# EasyEDA Pro project THMI_2024-07-26.epro

# Schematic Schematic1
Create Date: 2024-07-16; Page Name: P1; Project Name: #第九届立创电赛#温湿度检测仪; Schematic Name: Schematic1; Update Date: 2024-07-17
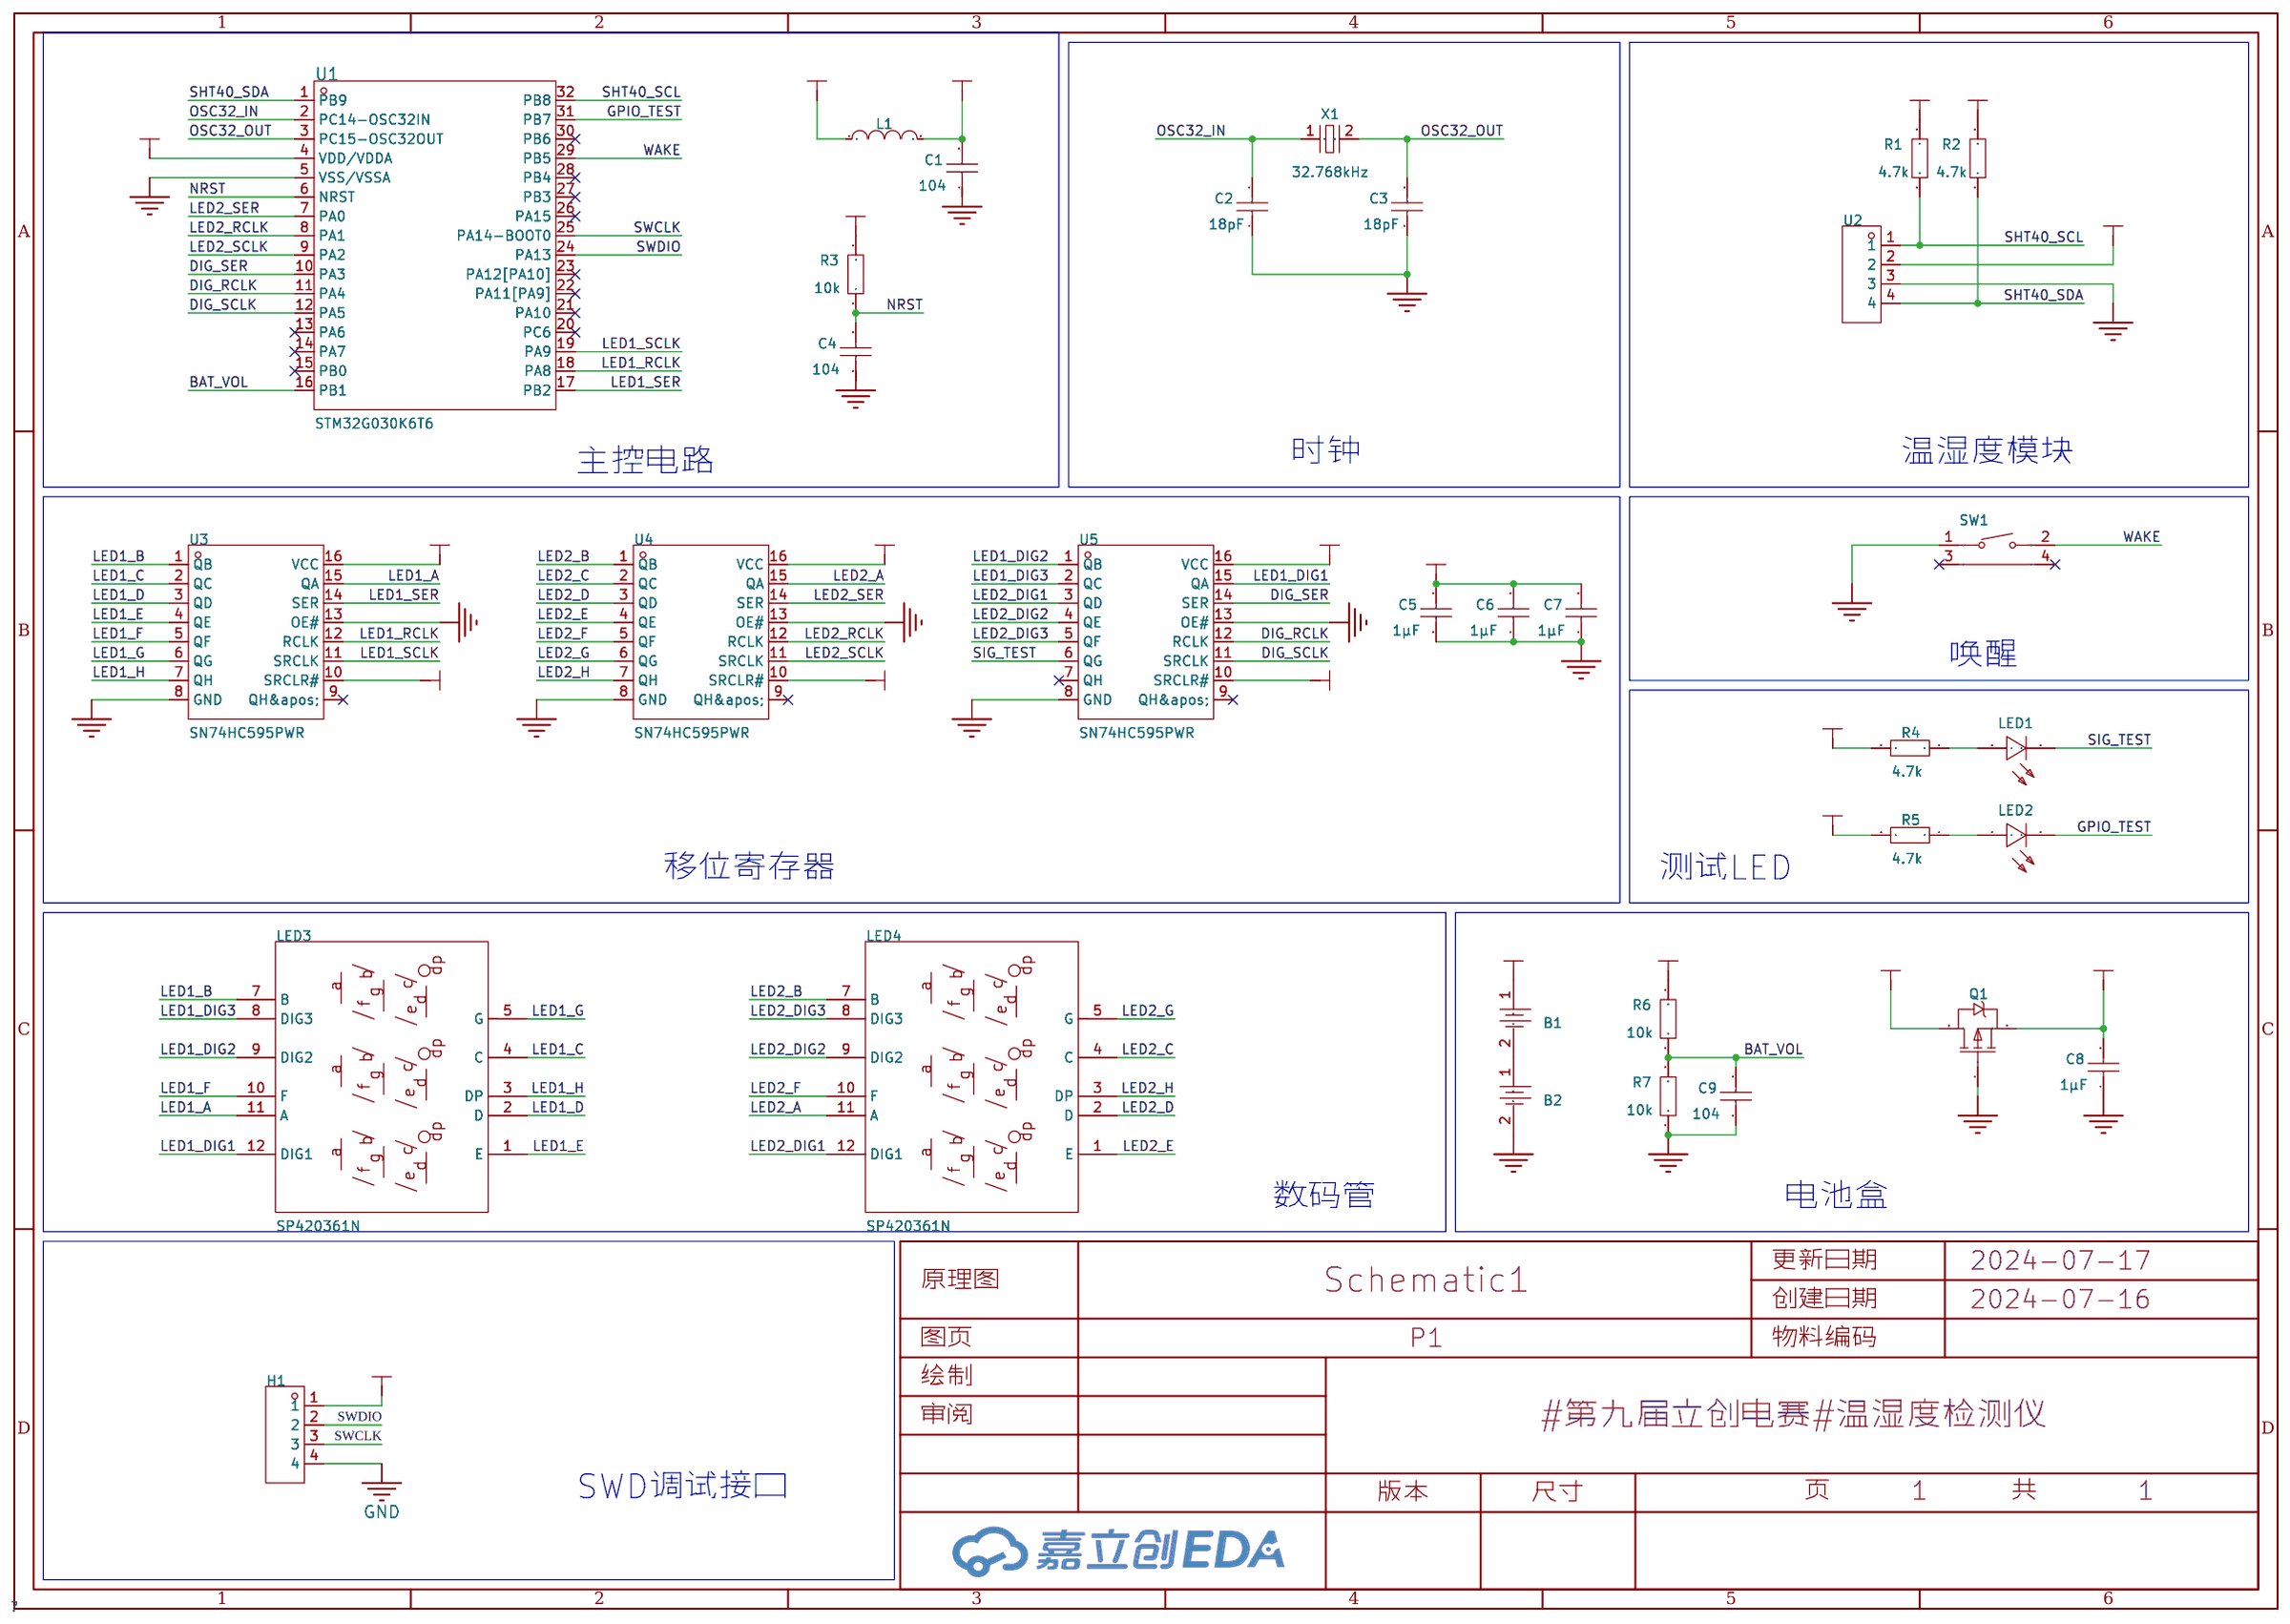
[diagram p0: schematic sheet]

## Parts
B1  BH-AA-A5BJ012  [BAT-TH_BH-AA-A5BJ012]
B2  BH-AA-A5BJ012  [BAT-TH_BH-AA-A5BJ012]
C1  104  [C0603]
C2  18pF  [C0603]
C3  18pF  [C0603]
C4  104  [C0603]
C5  1μF  [C0603]
C6  1μF  [C0603]
C7  1μF  [C0603]
C8  1μF  [C0603]
C9  104  [C0603]
H1  -  [HDR-TH_4P-P2.54-V-F]
L1  BLM21PG221SN1D  [L0805]
LED1  NCD0603G1  [LED0603-RD]
LED2  NCD0603G1  [LED0603-RD]
LED3  SP420361N  [LED-SEG-TH_SP420361N]
LED4  SP420361N  [LED-SEG-TH_SP420361N]
Q1  WST3401  [SOT-23-3_L2.9-W1.6-P1.90-LS2.8-BR]
R1  4.7k  [R0603]
R2  4.7k  [R0603]
R3  10k  [R0603]
R4  4.7k  [R0603]
R5  4.7k  [R0603]
R6  10k  [R0603]
R7  10k  [R0603]
SW1  TS-1010-C-A  [KEY-SMD_TX-1010-X-X]
U1  STM32G030K6T6  [LQFP-32_L7.0-W7.0-P0.80-LS9.0-BL]
U2  X1311FR-04-C43D24  [HDR-TH_4P-P1.27-H-F-W4.5-N]
U3  SN74HC595PWR  [TSSOP-16_L5.0-W4.4-P0.65-LS6.4-BL]
U4  SN74HC595PWR  [TSSOP-16_L5.0-W4.4-P0.65-LS6.4-BL]
U5  SN74HC595PWR  [TSSOP-16_L5.0-W4.4-P0.65-LS6.4-BL]
X1  32.768kHz  [CRYSTAL-SMD_L3.2-W1.5-1]

## Library data of the parts
B1 B2 = BH-AA-A5BJ012: 连接器类型:电池盒;适用电池规格:5号;; LCSC Part Name: 电池盒 适用电池:5号; Supplier Part: C5290180; Manufacturer: MYOUNG(美阳); JLCPCB Part Class: 扩展库; Datasheet: https://atta.szlcsc.com/upload/public/pdf/source/20221129/39BBE9EF152B2F12CD5AEA2F9E97207C.pdf; Supplier: LCSC; Connector Type: 电池盒; Battery Type: 5号
C1-C9 = CL10B332KB8NNNC: 容值:3.3nF;精度:±10%;额定电压:50V;材质(温度系数):X7R;; LCSC Part Name: 3.3nF ±10% 50V; Supplier Part: C1613; Manufacturer: SAMSUNG(三星); Supplier Footprint: 0603; JLCPCB Part Class: 基础库; Datasheet: https://atta.szlcsc.com/upload/public/pdf/source/20160218/1457707763339.pdf; Supplier: LCSC; Tolerance: ±10%; Voltage Rated: 50V; Temperature Coefficient: X7R
H1 = HDR-F_2.54_1x4P: Supplier Part: C2718488; Supplier Footprint: 插件
L1 = BLM21PG221SN1D: 标称阻抗@测试频率:220Ω@100MHz;误差:±25%;直流电阻(RDC):45mΩ;; LCSC Part Name: 单路 0805磁珠 阻抗220Ω@100MHz; Supplier Part: C85840; Manufacturer: muRata(村田); Supplier Footprint: 0805; JLCPCB Part Class: 扩展库; Datasheet: https://atta.szlcsc.com/upload/public/pdf/source/20180326/C118443_3FAC30E9A4F0E6B81275543C61E0685E.pdf; Supplier: LCSC; Impedance @ Frequency: 220Ω@100MHz; Tolerance: ±25%; DC Resistance: 45mΩ; Current Rating: 2A; Circuits: 1
LED1 LED2 = NCD0603G1: 发光颜色:翠绿色;正向电压(VF):2.6V~3.6V;功率:72mW;正向电流:10mA;主波长:515nm~530nm;透镜颜色:无色透明透镜;发光强度:330mcd~900mcd;发光角度:130°;工作温度:-30℃~+85℃;; Supplier Part: C84267; Manufacturer: 国星光电; Supplier Footprint: 0603; Datasheet: https://atta.szlcsc.com/upload/public/pdf/source/20200820/C84267_04BA7703640BAC111D09F5EFB971FBF3.pdf; Supplier: LCSC; Emitted Color: 翠绿色; Forward Voltage (VF): 2.6V~3.6V; Power Dissipation: 72mW; Forward Current: 10mA; Dominant Wavelength: 515nm~530nm; Lens Color: 无色透明透镜; Luminous Intensity: 330mcd~900mcd; Viewing Angle: 130°; Operating Temperature: -30℃~+85℃
LED3 LED4 = SP420361N: 数码管位数:3位;发光颜色:红色;LED极性:共阴极;数字/字母大小(英寸):0.36;; LCSC Part Name: 3位0.36英寸红色数码管 共阴极; Supplier Part: C98927; Manufacturer: ARKLED(方舟); Supplier Footprint: 插件; JLCPCB Part Class: 扩展库; Datasheet: https://atta.szlcsc.com/upload/public/pdf/source/20170713/C98927_1499918920582816853.pdf; Supplier: LCSC; Number of Characters: 3位; Luminous Color: 红色; LED Polarity: 共阴极; Digit/Alpha Size(inch): 0.36
Q1 = WST3401: 类型:1个P沟道;漏源电压(Vdss):30V;连续漏极电流(Id):5.5A;功率(Pd):1W;导通电阻(RDS(on)@Vgs,Id):52mΩ@10V,3A;阈值电压(Vgs(th)@Id):1.2V@250uA;; LCSC Part Name: 1个P沟道 耐压:30V 电流:5.5A; Supplier Part: C105162; Manufacturer: WINSOK(微硕); Supplier Footprint: SOT-23-3L; JLCPCB Part Class: 扩展库; Datasheet: https://atta.szlcsc.com/upload/public/pdf/source/20170518/1495085706351.pdf; Supplier: LCSC; Type: 1个P沟道; Drain Source Voltage (Vdss): 30V; Continuous Drain Current (Id): 5.5A; Power Dissipation (Pd): 1W; Drain Source On Resistance (RDS(on)@Vgs,Id): 52mΩ@10V,3A; Gate Threshold Voltage (Vgs(th)@Id): 1.2V@250uA
R1-R7 = 0603WAF4703T5E: 电阻类型:厚膜电阻;阻值:470kΩ;精度:±1%;功率:100mW;最大工作电压:75V;温度系数:±100ppm/℃;; LCSC Part Name: 470kΩ ±1% 100mW 厚膜电阻; Supplier Part: C23178; Manufacturer: UNI-ROYAL(厚声); Supplier Footprint: 0603; JLCPCB Part Class: 基础库; Datasheet: https://atta.szlcsc.com/upload/public/pdf/source/20200306/C422600_1E6D84923E4A46A82E41ADD87F860B5C.pdf; Supplier: LCSC; Type: 厚膜电阻; Tolerance: ±1%; Power(Watts): 100mW; Overload Voltage (Max): 75V; Temperature Coefficient: ±100ppm/℃; Operating Temperature Range: -55℃~+155℃
SW1 = TS-1010-C-A: 电路结构:单刀单掷;按钮形状:矩形按钮;作用力:260gf;安装方式:卧贴;开关长度:2.3mm;开关宽度:4.7mm;开关高度:3.5mm;带支架:不带;触点电流:50mA;额定电压(AC):-;额定电压(DC):12V;额定功率:-;绝缘电阻:-;带灯:无;机械寿命:10万次;; LCSC Part Name: 2.3*4.7*3.5mm 卧贴 轻触开关; Supplier Part: C692458; Manufacturer: XKB Connectivity(中国星坤); Supplier Footprint: SMD; Datasheet: https://atta.szlcsc.com/upload/public/pdf/source/20211011/09621D275CE0F472C941775DFBBCCC96.pdf; Supplier: LCSC; Circuit: 单刀单掷; Actuator Style: 矩形按钮; Operating Force: 260gf; Mounting Style: 卧贴; Switch Length: 2.3mm; Switch Width: 4.7mm; Switch Height: 3.5mm; Strike Gundam: 不带; Contact Current: 50mA; Voltage Rating (DC): 12V; Actuator/Cap Color: 黑色; With Lamp: 无; Mechanical Life: 10万次; Operating Temperature: -30℃~+85℃
U1 = STM32G030K6T6: CPU内核:CM0;程序存储容量:32KB;RAM总容量:8KB;GPIO端口数量:30;工作电压范围:2V~3.6V;CPU最大主频:64MHz;程序存储器类型:FLASH;; Supplier Part: C529331; Manufacturer: ST(意法半导体); Supplier Footprint: LQFP-32(7x7); JLCPCB Part Class: 扩展库; Datasheet: https://atta.szlcsc.com/upload/public/pdf/source/20200511/C529329_A1CB615556C746C4EA827FCAD1461480.pdf; Supplier: LCSC; CPU Core: CM0; Program Storage Size: 32KB; RAM Size: 8KB; GPIO Ports Number: 30; Operating Voltage Range: 2V~3.6V; CPU Maximum Speed: 64MHz; Program Memory Type: FLASH; Operating Temperature Range: -40℃~+85℃; ADC (Bit): 12bit; Peripheral/Function: DMA；PWM; Internal Oscillator: 有
U2 = X1311FR-04-C43D24: 插孔结构:1x4P;间距:1.27mm;行距:-;圆孔/方孔:方孔;安装类型:弯插;排数:单排;总孔位数:4P;额定电流:1A;额定电压:250V;插孔方向:侧面;塑高:4.3mm;触头材质:黄铜;触头镀层:金;工作温度范围:-40℃~+105℃;焊接温度(最大值):260℃;; LCSC Part Name: 间距:1.27mm 1x4P 弯插; Supplier Part: C2881475; Manufacturer: XKB Connectivity(中国星坤); Supplier Footprint: 弯插,P=1.27mm; JLCPCB Part Class: 扩展库; Datasheet: https://atta.szlcsc.com/upload/public/pdf/source/20211011/A24861EA633A2CD5B8EF341939930472.pdf; Supplier: LCSC; Holes Structure: 1x4P; Pitch: 1.27mm; Circular Hole / Square Hole: 方孔; Mounting Type: 弯插; Number of Rows: 单排; Number of Holes: 4P; Current Rating (Max): 1A; Voltage Rating (Max): 250V; Holes Direction: 侧面; Insulation Height: 4.3mm; Contact Material: 黄铜; Contact Plating: 金; Operating Temperature Range: -40℃~+105℃; Soldering Temperature(Max): 260℃
U3-U5 = SN74HC595PWR: 功能:串行至串行或并行;电源电压:2V~6V;元件数:1;每个元件位数:8;; LCSC Part Name: 三态输出 8位串行至串行或并行移位寄存器; Supplier Part: C273642; Manufacturer: TI(德州仪器); Supplier Footprint: TSSOP-16; JLCPCB Part Class: 扩展库; Datasheet: https://www.ti.com/cn/lit/gpn/sn74hc595; Supplier: LCSC; Function: 串行至串行或并行; Supply Voltage: 2V~6V; Number of Elements: 1; Number of Bits per Element: 8; Output Type: 三态; Series: 74HC; Operating Temperature: -40℃~+85℃
X1 = H31003271C2070CY: 晶振类型:贴片晶振;频率:32.768kHz;常温频差:±20ppm;外接负载电容:12.5pF;频率稳定度(全温):±30ppm;; LCSC Part Name: 32.768kHz ±20ppm 12.5pF; Supplier Part: C5361379; Manufacturer: JGHC(晶光华); Supplier Footprint: SMD3215-2P; JLCPCB Part Class: 扩展库; Datasheet: https://atta.szlcsc.com/upload/public/pdf/source/20240223/DA6BB0D04F2F206220D58296EAF6160A.pdf; Supplier: LCSC; Crystal Type: 贴片晶振; Normal temperature Frequency Tolerance: ±20ppm; External load capacitor: 12.5pF; Frequency Stability(Full temperature range): ±30ppm; Equivalent Series Resistance (ESR): 70kΩ; Operating Temperature: -40℃~+85℃

## Nets
3V: C5.2 C6.2 C7.2 C8.2 H1.1 L1.1 Q1.2(S) R1.2 R2.2 R3.2 R4.2 R5.2 R6.2 U2.2 U3.10(SRCLR#) U3.16(VCC) U4.10(SRCLR#) U4.16(VCC) U5.10(SRCLR#) U5.16(VCC)
GND: B2.2 C1.1 C2.1 C3.1 C4.1 C5.1 C6.1 C7.1 C8.1 C9.1 H1.4 Q1.1(G) R7.1 SW1.1 U1.5(VSS/VSSA) U2.3 U3.8(GND) U3.13(OE#) U4.8(GND) U4.13(OE#) U5.8(GND) U5.13(OE#)
VBAT: B1.1 Q1.3(D)
VDD: C1.2 L1.2 U1.4(VDD/VDDA)
BAT_VOL: C9.2 R6.1 R7.2 U1.16(PB1)
DIG_RCLK: U1.11(PA4) U5.12(RCLK)
DIG_SCLK: U1.12(PA5) U5.11(SRCLK)
DIG_SER: U1.10(PA3) U5.14(SER)
GPIO_TEST: LED2.1(K) U1.31(PB7)
LED1_A: LED3.11(A) U3.15(QA)
LED1_B: LED3.7(B) U3.1(QB)
LED1_C: LED3.4(C) U3.2(QC)
LED1_D: LED3.2(D) U3.3(QD)
LED1_DIG1: LED3.12(DIG1) U5.15(QA)
LED1_DIG2: LED3.9(DIG2) U5.1(QB)
LED1_DIG3: LED3.8(DIG3) U5.2(QC)
LED1_E: LED3.1(E) U3.4(QE)
LED1_F: LED3.10(F) U3.5(QF)
LED1_G: LED3.5(G) U3.6(QG)
LED1_H: LED3.3(DP) U3.7(QH)
LED1_RCLK: U1.18(PA8) U3.12(RCLK)
LED1_SCLK: U1.19(PA9) U3.11(SRCLK)
LED1_SER: U1.17(PB2) U3.14(SER)
LED2_A: LED4.11(A) U4.15(QA)
LED2_B: LED4.7(B) U4.1(QB)
LED2_C: LED4.4(C) U4.2(QC)
LED2_D: LED4.2(D) U4.3(QD)
LED2_DIG1: LED4.12(DIG1) U5.3(QD)
LED2_DIG2: LED4.9(DIG2) U5.4(QE)
LED2_DIG3: LED4.8(DIG3) U5.5(QF)
LED2_E: LED4.1(E) U4.4(QE)
LED2_F: LED4.10(F) U4.5(QF)
LED2_G: LED4.5(G) U4.6(QG)
LED2_H: LED4.3(DP) U4.7(QH)
LED2_RCLK: U1.8(PA1) U4.12(RCLK)
LED2_SCLK: U1.9(PA2) U4.11(SRCLK)
LED2_SER: U1.7(PA0) U4.14(SER)
NRST: C4.2 R3.1 U1.6(NRST)
OSC32_IN: C2.2 U1.2(PC14-OSC32IN) X1.1
OSC32_OUT: C3.2 U1.3(PC15-OSC32OUT) X1.2(GND)
SHT40_SCL: R1.1 U1.32(PB8) U2.1
SHT40_SDA: R2.1 U1.1(PB9) U2.4
SIG_TEST: LED1.1(K) U5.6(QG)
SWCLK: H1.3 U1.25(PA14-BOOT0)
SWDIO: H1.2 U1.24(PA13)
WAKE: SW1.2 U1.29(PB5)
$1N2720: LED1.2(A) R4.1
$1N2760: LED2.2(A) R5.1
$1N3214: B1.2 B2.1

Not connected (* = marked no-connect by the designer): SW1 3* 4*; U1 13(PA6)* 14(PA7)* 15(PB0)* 20(PC6)* 21(PA10)* 22(PA11[PA9])* 23(PA12[PA10])* 26(PA15)* 27(PB3)* 28(PB4)* 30(PB6)*; U3 9(QH&apos;)*; U4 9(QH&apos;)*; U5 7(QH)* 9(QH&apos;)*

## Notes on the sheet
- 主控电路
- 时钟
- 温湿度模块
- 唤醒
- 移位寄存器
- 测试LED
- 数码管
- 电池盒
- SWD调试接口

# Board PCB1
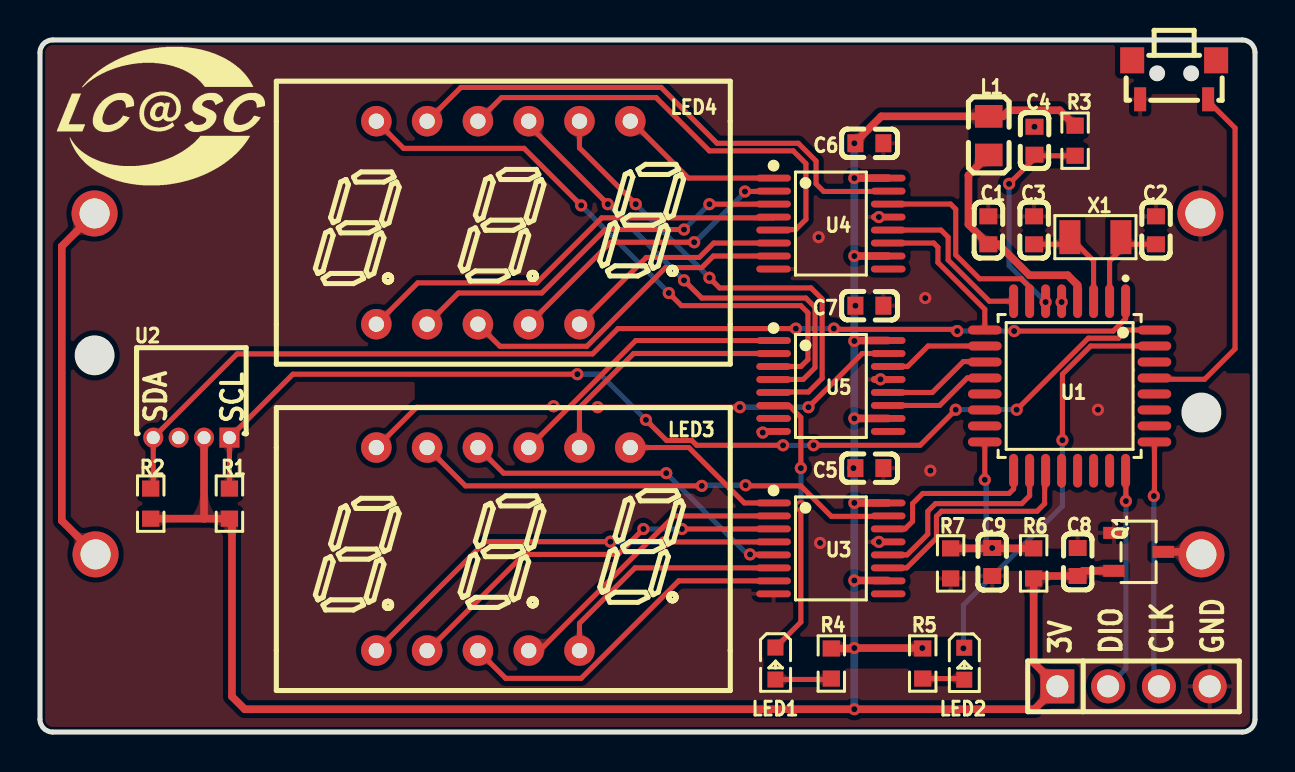
[diagram p1: board, top side]
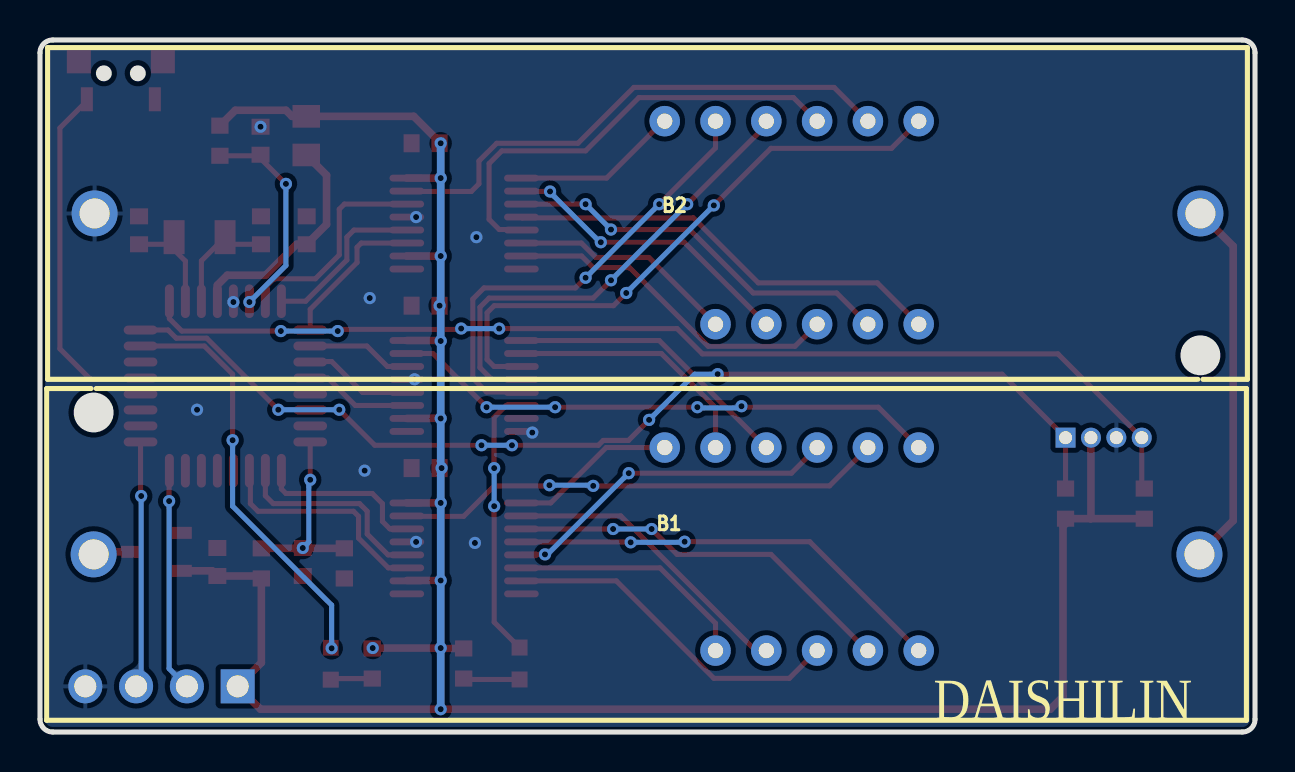
[diagram p2: board, bottom side, seen from below]

Outline 60.76 x 34.63 mm; copper layers: Top Layer, Bottom Layer. Coordinates in mm from the lower left corner of the outline.
Outline path: 0,34 arc(0.19,34.45) 0.63,34.63 60.13,34.63 arc(60.58,34.45) 60.76,34 60.76,0.64 arc(60.58,0.19) 60.13,0 0.63,0 arc(0.19,0.19) 0,0.64 0,34
Stack: Top Layer 0.035mm / Dielectric1 1.51mm FR4 er 4.5 / Bottom Layer 0.035mm

## Design rules (mm)
template: JLCPCB Capability(Two Layers Board)
spacing copperThickness1oz (default): track to track 0.102, other pairs 0.152 to 0.3
spacing copperThickness2oz: track to track 0.203, other pairs 0.152 to 0.3
track width copperThickness1oz (default): min 0.127, default 0.254, max 2.54
track width copperThickness2oz: min 0.203, default 0.254, max 2.54
differential pair differentialPair (default): width min 0.127, default 0.254, max 2.54; gap min 0.152, default 0.152
via viaSize (default): diameter min 0.5, default 0.61, max 10; hole min 0.3, default 0.305, max 6.3

## Placement (name value [footprint] x y rotation side)
B1  BH-AA-A5BJ012  [BAT-TH_BH-AA-A5BJ012]  30.43 8.89 180 bottom
B2  BH-AA-A5BJ012  [BAT-TH_BH-AA-A5BJ012]  30.38 25.95 0 bottom
C1  104  [C0603]  47.43 25.11 270 top
C2  18pF  [C0603]  55.81 25.11 270 top
C3  18pF  [C0603]  49.71 25.11 270 top
C4  104  [C0603]  49.73 29.59 270 top
C5  1μF  [C0603]  41.48 13.21 180 top
C6  1μF  [C0603]  41.48 29.46 180 top
C7  1μF  [C0603]  41.48 21.34 180 top
C8  1μF  [C0603]  51.89 8.51 270 top
C9  104  [C0603]  47.62 8.51 90 top
H1  -  [HDR-TH_4P-P2.54-V-F]  54.69 2.29 0 top
L1  BLM21PG221SN1D  [L0805]  47.45 29.84 270 top
LED1  NCD0603G1  [LED0603-RD]  36.78 3.43 270 top
LED2  NCD0603G1  [LED0603-RD]  46.22 3.42 270 top
LED3  SP420361N  [LED-SEG-TH_SP420361N]  23.17 9.16 270 top
LED4  SP420361N  [LED-SEG-TH_SP420361N]  23.17 25.49 270 top
Q1  WST3401  [SOT-23-3_L2.9-W1.6-P1.90-LS2.8-BR]  54.94 9.02 180 top
R1  4.7k  [R0603]  9.47 11.43 270 top
R2  4.7k  [R0603]  5.54 11.43 270 top
R3  10k  [R0603]  51.77 29.59 90 top
R4  4.7k  [R0603]  39.57 3.43 90 top
R5  4.7k  [R0603]  44.15 3.43 90 top
R6  10k  [R0603]  49.69 8.44 270 top
R7  10k  [R0603]  45.54 8.44 90 top
SW1  TS-1010-C-A  [KEY-SMD_TX-1010-X-X]  56.72 32.64 0 top
U1  STM32G030K6T6  [LQFP-32_L7.0-W7.0-P0.80-LS9.0-BL]  51.49 17.32 180 top
U2  X1311FR-04-C43D24  [HDR-TH_4P-P1.27-H-F-W4.5-N]  7.57 14.73 180 top
U3  SN74HC595PWR  [TSSOP-16_L5.0-W4.4-P0.65-LS6.4-BL]  39.55 9.19 270 top
U4  SN74HC595PWR  [TSSOP-16_L5.0-W4.4-P0.65-LS6.4-BL]  39.55 25.45 270 top
U5  SN74HC595PWR  [TSSOP-16_L5.0-W4.4-P0.65-LS6.4-BL]  39.55 17.32 270 top
X1  32.768kHz  [CRYSTAL-SMD_L3.2-W1.5-1]  52.78 24.77 180 top

## Footprints (pads in the part's own frame, mm; a bottom-side part is the same pattern mirrored in y, then rotated)
BAT-TH_BH-AA-A5BJ012
  round 2.3 hole 1.5: 1(-27.65,0) 2(27.65,0)
C0603
  rect 0.8x0.9 smd: 1(-0.7,0) 2(0.7,0)
CRYSTAL-SMD_L3.2-W1.5-1
  rect 1.05x1.7 smd: 1(-1.275,0) 2(1.275,0)
HDR-TH_4P-P1.27-H-F-W4.5-N
  rect 1x1 hole 0.65: 1(-1.905,0)
  round 1 hole 0.65: 2(-0.635,0) 3(0.635,0) 4(1.905,0)
HDR-TH_4P-P2.54-V-F
  rect 1.7x1.7 hole 1.1: 1(-3.81,0)
  round 1.7 hole 1.1: 2(-1.27,0) 3(1.27,0) 4(3.81,0)
KEY-SMD_TX-1010-X-X
  rect 0.6x1.2 smd: 1(-1.7,-0.975) 2(1.7,-0.975)
  rect 1.2x1.3 smd: 3(-2.1,0.975) 4(2.1,0.975)
L0805
  rect 1.133x1.377 smd: 1(-0.966,0) 2(0.966,0)
LED0603-RD
  rect 0.8x0.8 smd: 1(-0.799,0) 2(0.799,0)
LED-SEG-TH_SP420361N
  round 1.524 hole 0.762: 1(5.08,-6.35) 2(5.08,-3.81) 3(5.08,-1.27) 4(5.08,1.27) 5(5.08,3.81) 7(-5.08,6.35) 8(-5.08,3.81) 9(-5.08,1.27) 10(-5.08,-1.27) 11(-5.08,-3.81) 12(-5.08,-6.35)
LQFP-32_L7.0-W7.0-P0.80-LS9.0-BL
  oval 0.448x1.684 smd: 1(-2.8,-4.242) 2(-2,-4.242) 3(-1.2,-4.242) 4(-0.4,-4.242) 5(0.4,-4.242) 6(1.2,-4.242) 7(2,-4.242) 8(2.8,-4.242) 17(2.8,4.242) 18(2,4.242) 19(1.2,4.242) 20(0.4,4.242) 21(-0.4,4.242) 22(-1.2,4.242) 23(-2,4.242) 24(-2.8,4.242)
  oval 1.684x0.448 smd: 9(4.242,-2.8) 10(4.242,-2) 11(4.242,-1.2) 12(4.242,-0.4) 13(4.242,0.4) 14(4.242,1.2) 15(4.242,2) 16(4.242,2.8) 25(-4.242,2.8) 26(-4.242,2) 27(-4.242,1.2) 28(-4.242,0.4) 29(-4.242,-0.4) 30(-4.242,-1.2) 31(-4.242,-2) 32(-4.242,-2.8)
R0603
  rect 0.806x0.864 smd: 1(-0.753,0) 2(0.753,0)
SOT-23-3_L2.9-W1.6-P1.90-LS2.8-BR
  rect 1.07x0.6 smd: 1(1.235,-0.95) 2(1.235,0.95) 3(-1.235,0)
TSSOP-16_L5.0-W4.4-P0.65-LS6.4-BL
  oval 0.343x1.732 smd: 1(-2.275,-2.866) 2(-1.625,-2.866) 3(-0.975,-2.866) 4(-0.325,-2.866) 5(0.325,-2.866) 6(0.975,-2.866) 7(1.625,-2.866) 8(2.275,-2.866) 9(2.275,2.866) 10(1.625,2.866) 11(0.975,2.866) 12(0.325,2.866) 13(-0.325,2.866) 14(-0.975,2.866) 15(-1.625,2.866) 16(-2.275,2.866)

## Nets
As in the schematic.

Pads without a net: SW1 3 4; U1 13 14 15 20 21 22 23 26 27 28 30; U3 9; U4 9; U5 7 9

## Via types
v1: diameter 0.61, hole 0.305, Top Layer to Bottom Layer, 65 vias

## Routing (per net, layer and track width the routed paths; a pad name or vN(x,y) marks a point on that pad's centre or on a via; arc(x,y) is an arc through that point)
3V: length 124.3
  Top Layer w0.254: v1(44.12,4.2) R5.2
  Top Layer w0.381: v1(40.72,7.58) 42.4,7.58 ; U2.2 8.2,10.69 8.22,10.68 ; v1(40.72,19.57) 40.75,19.59 U5.16 ; v1(44.12,4.2) v1(40.72,4.2) 40.7,4.18 R4.2 ; v1(40.72,29.46) 42.07,30.81 L1.1 48.16,30.81 48.46,31.11 51,31.11 R3.2 ; 53.71,8.07 52.15,8.07 C8.2 49.82,7.81 R6.2 49.69,3.47 H1.1 49.73,1.14 v1(40.72,1.14) 10.24,1.14 9.6,1.78 9.6,10.3 9.22,10.68 ; v1(40.72,11.47) U3.16 ; 8.22,10.68 R2.2 ; 8.22,10.68 9.22,10.68 ; v1(40.72,27.72) U4.16 ; 9.22,10.68 9.3,10.76 9.39,10.76 R1.2 ; v1(40.72,15.69) U5.10 ; v1(40.72,23.82) U4.10
  Bottom Layer w0.381: v1(40.72,1.14) v1(40.72,4.2) v1(40.72,7.58) v1(40.72,11.47) v1(40.72,15.69) v1(40.72,19.57) v1(40.72,23.82) v1(40.72,27.72) v1(40.72,29.46)
  vias: v1(40.68,13.21) v1(40.78,21.34)
GND:
  vias: v1(36.14,14.99) v1(38.94,24.77) v1(39.01,9.46) v1(41.95,25.77) v1(42.03,17.65) v1(41.95,9.51) v1(44.27,21.72) v1(44.53,13.08) v1(49.73,30.29) v1(51.09,21.52) v1(52.91,16.13)
VBAT: length 2
  Top Layer w0.381: Q1.3 57.95,9.02 B1.1
VDD: length 11.4
  Top Layer w0.381: L1.2 46.43,27.86 46.43,25.4 C1.2 47.93,24.41 49.48,22.86 51.4,22.86 51.89,22.36 51.89,21.56
BAT_VOL: length 9.6
  Top Layer w0.254: U1.16 v1(47.25,12.62)
  Top Layer w0.381: R6.1 R7.2
  Bottom Layer w0.254: v1(47.62,9.21) 47.32,9.51 47.32,12.55 v1(47.25,12.62)
DIG_RCLK: length 5.5
  Top Layer w0.254: U5.12 44.63,16.99 46.18,18.54 47.22,18.54 U1.11
DIG_SCLK: length 5.4
  Top Layer w0.254: U1.12 46.37,17.72 44.99,16.34 U5.11
DIG_SER: length 5.3
  Top Layer w0.254: U5.14 43.39,18.29 44.41,19.32 U1.10
GPIO_TEST: length 21
  Top Layer w0.254: LED2.1 46.19,4.19 v1(46.18,4.19) ; 55.73,19.32 52.54,19.32 51.13,17.91 v1(51.13,14.61)
  Bottom Layer w0.254: v1(46.18,4.19) 46.18,6.35 51.13,11.3 v1(51.13,14.61)
LED1_A: length 24.5
  Top Layer w0.254: U3.15 42.4,10.8 39.57,10.8 38.05,12.32 35.32,12.32 v1(35.29,12.35) ; LED3.11 21.28,12.32 v1(33.1,12.32)
  Bottom Layer w0.254: v1(33.1,12.32) 33.13,12.35 v1(35.29,12.35)
LED1_B: length 8.3
  Top Layer w0.254: LED3.7 32.45,14.24 35.22,11.47 U3.1
LED1_C: length 15
  Top Layer w0.254: U3.2 31.72,10.81 24.98,4.08 LED3.4
LED1_D: length 19.8
  Top Layer w0.254: v1(30.18,10.16) 28.91,8.89 24.21,8.89 19.39,4.08 LED3.2 ; v1(32.1,10.16) 36.68,10.16 U3.3
  Bottom Layer w0.254: v1(30.18,10.16) v1(32.1,10.16)
LED1_DIG1: length 27.6
  Top Layer w0.254: v1(38.43,16.26) 41.12,18.94 U5.15 ; v1(25.68,16.3) 25.63,16.26 18.84,16.26 LED3.12 ; v1(27.89,16.26) v1(35,16.26)
  Bottom Layer w0.254: v1(25.68,16.3) 25.77,16.22 27.85,16.22 v1(27.89,16.26) ; v1(35,16.26) v1(38.43,16.26)
LED1_DIG2: length 14.5
  Top Layer w0.254: LED3.9 29.8,19.59 U5.1
LED1_DIG3: length 12.8
  Top Layer w0.254: U5.2 29.69,18.94 26.98,16.24 LED3.8
LED1_E: length 22.1
  Top Layer w0.254: v1(28.52,9.53) 22.27,9.53 LED3.1 ; v1(31.22,9.49) 31.25,9.51 U3.4
  Bottom Layer w0.254: v1(28.52,9.53) 28.56,9.49 v1(31.22,9.49)
LED1_F: length 17
  Top Layer w0.254: v1(35.51,8.89) 36.66,8.89 U3.5 ; v1(31.32,12.95) 23.18,12.95 LED3.10
  Bottom Layer w0.254: v1(35.51,8.89) 35.38,8.89 v1(31.32,12.95)
LED1_G: length 12.2
  Top Layer w0.254: U3.6 29.75,8.21 26.98,5.44 LED3.5
LED1_H: length 17.4
  Top Layer w0.254: U3.7 31.94,7.56 27.06,2.69 23.29,2.69 LED3.3
LED1_RCLK: length 10.2
  Top Layer w0.254: U3.12 43.36,8.86 44.4,9.91 44.4,11.05 44.78,11.43 49.1,11.43 49.49,11.82 U1.18
LED1_SCLK: length 11.5
  Top Layer w0.254: U1.19 50.24,13.03 50.24,11.43 49.86,11.05 45.09,11.05 44.83,10.8 44.83,9.7 43.34,8.21 U3.11
LED1_SER: length 8.5
  Top Layer w0.254: U1.17 48.69,12.17 48.46,11.94 44.15,11.94 43.64,11.43 43.64,10.54 43.26,10.17 U3.14
LED2_A: length 26.6
  Top Layer w0.254: U4.15 42.4,27.05 39.19,27.05 38.81,27.43 38.81,28.58 37.92,29.46 33.86,29.46 31.06,32.26 21.05,32.26 LED4.11
LED2_B: length 8.3
  Top Layer w0.254: U4.1 32.43,27.72 29.58,30.57 LED4.7
LED2_C: length 15
  Top Layer w0.254: v1(35.26,27.05) 36.67,27.05 U4.2 ; LED4.4 28.54,24.51 v1(32.72,24.51)
  Bottom Layer w0.254: v1(35.26,27.05) 35.26,27.01 32.75,24.51 v1(32.72,24.51)
LED2_D: length 19.8
  Top Layer w0.254: LED4.2 20.92,21.97 25.1,21.97 28.27,25.15 v1(32.21,25.15) ; U4.3 36.68,26.42 v1(33.48,26.42)
  Bottom Layer w0.254: v1(32.21,25.15) v1(33.48,26.42)
LED2_DIG1: length 29.8
  Top Layer w0.254: v1(31.45,21.97) 32.08,21.34 38.05,21.34 38.4,20.98 38.4,18.64 38.05,18.29 U5.3 ; v1(27.06,26.35) 24.21,29.21 18.18,29.21 LED4.12
  Bottom Layer w0.254: v1(27.06,26.35) 31.45,21.97
LED2_DIG2: length 23.6
  Top Layer w0.254: v1(32.21,22.61) 33.1,21.72 38.3,21.72 38.76,21.26 38.76,18.24 38.17,17.64 U5.4 ; v1(28.4,26.42) 24.44,30.37 LED4.9
  Bottom Layer w0.254: v1(28.4,26.42) v1(32.21,22.61)
LED2_DIG3: length 23.3
  Top Layer w0.254: LED4.8 26.98,29.23 v1(29.79,26.42) ; v1(33.48,22.73) 33.99,22.22 38.56,22.22 39.12,21.67 39.12,17.7 38.43,17.02 36.71,17.02 U5.5
  Bottom Layer w0.254: v1(29.79,26.42) v1(33.48,22.73)
LED2_E: length 22.1
  Top Layer w0.254: LED4.1 18.89,22.48 24.84,22.48 28.09,25.73 36.65,25.73 U4.4
LED2_F: length 22.9
  Top Layer w0.254: LED4.10 23.08,31.75 30.81,31.75 33.48,29.08 37.67,29.08 38.3,28.45 38.3,25.65 37.8,25.15 36.71,25.15 U4.5
LED2_G: length 11.4
  Top Layer w0.254: LED4.5 30.32,23.75 32.97,23.75 33.69,24.47 U4.6
LED2_H: length 17.1
  Top Layer w0.254: LED4.3 23,19.3 27.35,19.3 31.28,23.24 33.1,23.24 33.68,23.82 U4.7
LED2_RCLK: length 8.4
  Top Layer w0.254: 48.69,21.56 47.48,21.56 45.42,23.62 45.42,24.77 45.06,25.12 U4.12
LED2_SCLK: length 7.7
  Top Layer w0.254: U4.11 44.69,24.47 44.91,24.26 44.91,23.5 47.25,21.15 U1.9
LED2_SER: length 10.8
  Top Layer w0.254: 49.49,21.56 49.49,22.25 49.07,22.68 46.99,22.68 45.8,23.88 45.8,26.16 45.54,26.42 U4.14
NRST: length 10.7
  Top Layer w0.254: 49.79,28.84 49.79,28.76 v1(48.46,27.43) ; 49.79,28.84 R3.1 ; 49.79,28.84 C4.2
  Bottom Layer w0.254: v1(48.46,27.43) 48.46,23.35 v1(50.29,21.52)
OSC32_IN: length 5.3
  Top Layer w0.254: 53.49,21.56 53.49,23.57 54.06,24.14 X1.1 54.41,24.41 C2.2
OSC32_OUT: length 5.6
  Top Layer w0.254: 52.69,21.56 52.69,23.58 X1.2 51.15,24.41 C3.2
SHT40_SCL: length 54
  Top Layer w0.254: v1(38.68,14.35) 44.02,14.35 v1(45.8,16.13) ; 55.73,20.12 54.36,20.12 53.95,19.71 52.43,19.71 v1(48.84,16.13) ; v1(30.3,15.62) 31.33,14.59 32.6,14.59 32.84,14.35 v1(37.16,14.35) ; R1.1 U2.1 12.65,17.91 v1(26.87,17.91)
  Bottom Layer w0.254: v1(26.87,17.91) 28.02,17.91 v1(30.3,15.62) ; v1(38.68,14.35) v1(37.16,14.35) ; v1(48.84,16.13) v1(45.8,16.13)
SHT40_SDA: length 54.7
  Top Layer w0.254: v1(48.72,20.07) 53.67,20.07 54.29,20.69 54.29,21.56 ; v1(39.7,20.19) 39.74,20.15 45.79,20.15 v1(45.87,20.07) ; v1(37.8,20.19) 28.9,20.19 27.64,18.92 9.86,18.92 U2.4 5.66,12.31 R2.1
  Bottom Layer w0.254: v1(39.7,20.19) 39.7,20.19 v1(37.8,20.19) ; v1(48.72,20.07) v1(45.87,20.07)
SIG_TEST: length 13.7
  Top Layer w0.254: v1(38.05,13.21) 38.05,15.75 37.45,16.34 U5.6 ; LED1.1 38.05,5.5 v1(38.05,11.3)
  Bottom Layer w0.254: v1(38.05,13.21) v1(38.05,11.3)
SWCLK: length 12.3
  Top Layer w0.254: 55.73,14.52 55.73,11.84 v1(55.7,11.81)
  Bottom Layer w0.254: H1.3 55.7,2.54 v1(55.7,11.81)
SWDIO: length 11.2
  Top Layer w0.254: v1(54.31,11.56) 54.31,13.06 U1.24
  Bottom Layer w0.254: H1.2 54.31,3.17 v1(54.31,11.56)
WAKE: length 17.7
  Top Layer w0.254: SW1.2 58.42,31.57 59.77,30.23 59.77,19.18 58.24,17.65 55.8,17.65 55.73,17.72
$1N2720: length 2.8
  Top Layer w0.254: LED1.2 39.53,2.63 R4.1
$1N2760: length 2.1
  Top Layer w0.254: LED2.2 46.16,2.68 R5.1
$1N3214: length 18.4
  Top Layer w0.381: B2.1 1.09,24.31 1.09,10.58 B1.2

## Copper pours and planes (outline as drawn; the poured copper is in the pictures)
GND on Top Layer: -3.1,38.1 70.05,38.1 70.05,-3.68 -3.1,-3.68
GND on Bottom Layer: -5.89,40.89 62.18,40.89 62.18,-23.75 -5.89,-23.75

Small or netless copper shapes (teardrops, artwork), in the pictures only: 161 on Top Layer, 64 on Bottom Layer

## Text on the board
Bottom Silkscreen Layer: DAISHILIN
Top Silkscreen Layer: SCL | 3V | DIO | CLK | GND | SDA
